# EAGLE schematic imsensor-esp-v01 (EAGLE 7.5.0)
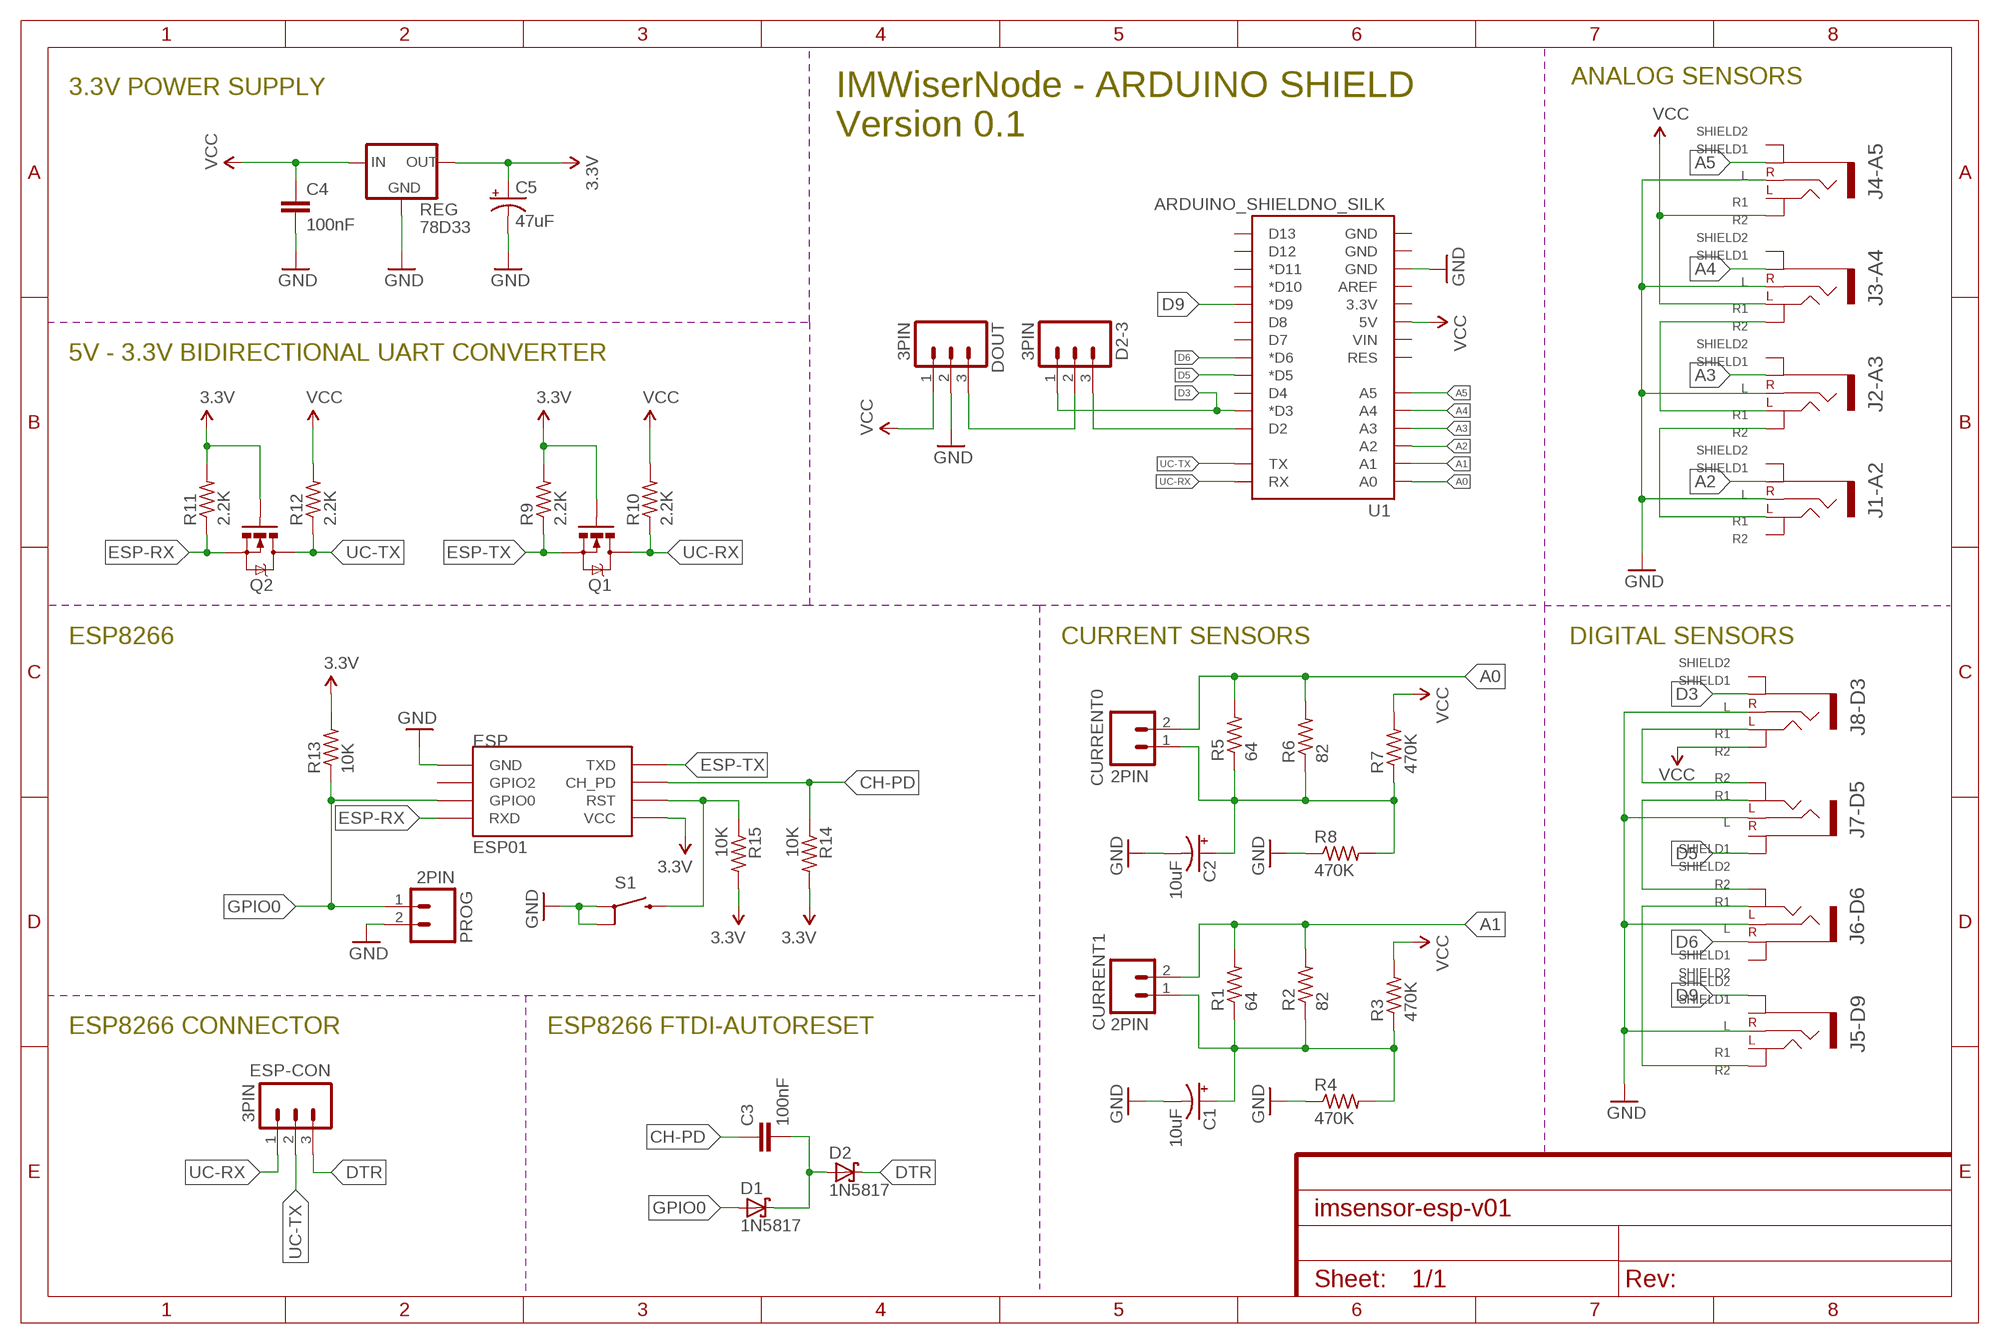
[diagram p0: schematic, sheet 1]
FRAME1 (FRAME-A4L): CNAME: IMSensorNode; CREVISION: REV A; DESIGNER: Jeferson Lima

## Parts
C1  10uF  10UF-25V-20%(PTH)  [CPOL-RADIAL-10UF-25V]
C2  10uF  10UF-25V-20%(PTH)  [CPOL-RADIAL-10UF-25V]
C3  100nF  CAPPTH  [CAP-PTH-SMALL]
C4  100nF  CAPPTH  [CAP-PTH-SMALL]
C5  47uF  10UF-25V-20%(PTH)  [CPOL-RADIAL-10UF-25V]
CURRENT0  2PIN  M02PTH  [1X02]
CURRENT1  2PIN  M02PTH  [1X02]
D1  1N5817  SCHOTTKY-DIODEDO41-7  [DO41-7]
D2  1N5817  SCHOTTKY-DIODEDO41-7  [DO41-7]
D2-3  3PIN  M03PTH  [1X03]
DOUT  3PIN  M03PTH  [1X03]
ESP  ESP01  [ESP01]
ESP-CON  3PIN  M03PTH  [1X03]
J1-A2  PJ-313-SPAD  [PJ-313-5PIN-SMALL]
J2-A3  PJ-313-SPAD  [PJ-313-5PIN-SMALL]
J3-A4  PJ-313-SPAD  [PJ-313-5PIN-SMALL]
J4-A5  PJ-313-SPAD  [PJ-313-5PIN-SMALL]
J5-D9  PJ-313-SPAD  [PJ-313-5PIN-SMALL]
J6-D6  PJ-313-SPAD  [PJ-313-5PIN-SMALL]
J7-D5  PJ-313-SPAD  [PJ-313-5PIN-SMALL]
J8-D3  PJ-313-SPAD  [PJ-313-5PIN-SMALL]
PROG  2PIN  M02PTH  [1X02]
Q1  MOSFET-NCHANNEL2N7000  [TO-92]
Q2  MOSFET-NCHANNEL2N7000  [TO-92]
R1  64  R-US_0207/10  [0207/10]
R2  82  R-US_0207/10  [0207/10]
R3  470K  R-US_0207/10  [0207/10]
R4  470K  R-US_0207/10  [0207/10]
R5  64  R-US_0207/10  [0207/10]
R6  82  R-US_0207/10  [0207/10]
R7  470K  R-US_0207/10  [0207/10]
R8  470K  R-US_0207/10  [0207/10]
R9  2.2K  R-US_0207/10  [0207/10]
R10  2.2K  R-US_0207/10  [0207/10]
R11  2.2K  R-US_0207/10  [0207/10]
R12  2.2K  R-US_0207/10  [0207/10]
R13  10K  R-US_0207/10  [0207/10]
R14  10K  R-US_0207/10  [0207/10]
R15  10K  R-US_0207/10  [0207/10]
REG  78D33  V_REG_78XXSINK  [TO220-IGO]
S1  SWITCH-MOMENTARY-2PTH  [TACTILE-PTH]
U1  ARDUINO_SHIELDNO_SILK  [DUEMILANOVE_VIAS]

## Nets
3.3V: C5.1(+) ESP.VCC Q1.2(G) Q2.2(G) R9.2 R11.2 R13.2 R14.2 R15.2 REG.OUT
A0: CURRENT0.2 R5.2 R6.2 U1.A0
A1: CURRENT1.2 R1.2 R2.2 U1.A1
A2: J1-A2.1.1(SHIELD1) U1.A2
A3: J2-A3.1.1(SHIELD1) U1.A3
A4: J3-A4.1.1(SHIELD1) U1.A4
A5: J4-A5.1.1(SHIELD1) U1.A5
BURDEN-C0: C2.1(+) CURRENT0.1 R5.1 R6.1 R7.1 R8.2
BURDEN-C1: C1.1(+) CURRENT1.1 R1.1 R2.1 R3.1 R4.2
CH-PD: C3.1 ESP.CH_PD R14.1
D3: D2-3.1 J8-D3.1.1(SHIELD1) U1.D3(*D3)
D5: J7-D5.1.2(SHIELD2) U1.D5(*D5)
D6: J6-D6.1.1(SHIELD1) U1.D6(*D6)
D9: J5-D9.1.2(SHIELD2) U1.D9(*D9)
DTR: D2.C ESP-CON.3
ESP-RX: ESP.RX(RXD) Q2.1(S) R11.1
ESP-TX: ESP.TX(TXD) Q1.1(S) R9.1
GND: C1.2(-) C2.2(-) C4.2 C5.2(-) DOUT.2 ESP.GND J1-A2.2(R) J2-A3.2(R) J3-A4.2(R) J4-A5.2(R) J5-D9.2(R) J6-D6.2(R) J7-D5.2(R) J8-D3.2(R) PROG.2 R4.1 R8.1 REG.GND S1.1 S1.2 U1.GND@2(GND)
GPIO0: D1.A ESP.GPIO0 PROG.1 R13.1
N$1: J2-A3.3.1(L1) J3-A4.3.2(L2)
N$2: J1-A2.3.1(L1) J2-A3.3.2(L2)
N$7: J7-D5.3.2(L2) J8-D3.3.1(L1)
N$8: D2-3.2 DOUT.3
N$9: J6-D6.3.2(L2) J7-D5.3.1(L1)
N$14: D2-3.3 U1.D2
N$16: J5-D9.3.2(L2) J6-D6.3.1(L1)
RST: ESP.RST R15.1 S1.3
U$1: C3.2 D1.C D2.A
UC-RX: ESP-CON.1 Q1.3(D) R10.1 U1.RX
UC-TX: ESP-CON.2 Q2.3(D) R12.1 U1.TX
VCC: C4.1 DOUT.1 J3-A4.3.1(L1) J4-A5.3.2(L2) J8-D3.3.2(L2) R3.2 R7.2 R10.2 R12.2 REG.IN U1.5V
Unconnected: ESP.GPIO2 J1-A2.1.2(SHIELD2) J1-A2.3.2(L2) J2-A3.1.2(SHIELD2) J3-A4.1.2(SHIELD2) J4-A5.1.2(SHIELD2) J4-A5.3.1(L1) J5-D9.1.1(SHIELD1) J5-D9.3.1(L1) J6-D6.1.2(SHIELD2) J7-D5.1.1(SHIELD1) J8-D3.1.2(SHIELD2) U1.3.3V U1.AREF U1.D4 U1.D7 U1.D8 U1.D10(*D10) U1.D11(*D11) U1.D12 U1.D13 U1.GND@0(GND) U1.GND@1(GND) U1.RES U1.VIN

## Notes on the sheet
- IMWiserNode - ARDUINO SHIELD
  Version 0.1
- ANALOG SENSORS
- 3.3V POWER SUPPLY
- 5V - 3.3V BIDIRECTIONAL UART CONVERTER
- ESP8266 | CURRENT SENSORS | DIGITAL SENSORS
- ESP8266 CONNECTOR | ESP8266 FTDI-AUTORESET

## Library data of the parts
C1 C2 C5 = SparkFun-Capacitors:10UF-25V-20%(PTH): CAP-08440; PROD_ID: CAP-08440
C3 C4 = SparkFun-Capacitors:CAP: Capacitor Standard 0603 ceramic capacitor, and 0.1" leaded capacitor.
CURRENT0 CURRENT1 PROG = SparkFun-Connectors:M02: Standard 2-pin 0.1" header. Use with - straight break away headers ( PRT-00116) - right angle break away headers (PRT-00553) - swiss pins (PRT-00743) - machine pins (PRT-00117) - female headers (PRT-00115) Molex polarized connector foot print use with: PRT-08233 with associated crimp pins and housings. 2.54_SCREWTERM for use with PRT-10571. 3.5mm Screw Terminal footprints for PRT-08084 5mm Screw Terminal footprints for use with PRT-08432
D1 D2 = adafruit:SCHOTTKY-DIODE: Schottky Diode
D2-3 DOUT ESP-CON = SparkFun-Connectors:M03: Header 3 Standard 3-pin 0.1" header. Use with straight break away headers (SKU : PRT-00116), right angle break away headers (PRT-00553), swiss pins (PRT-00743), machine pins (PRT-00117), and female headers (PRT-00115). Molex polarized connector foot print use with SKU : PRT-08232 with associated crimp pins and housings.
ESP = esp8266-modules:ESP01: ESP8266 Wifi module 01
J1-A2 J2-A3 J3-A4 J4-A5 J5-D9 J6-D6 J7-D5 J8-D3 = salvador-parts:PJ-313-SPAD: PJ-313 with octagon pads PJ-313 with small octagon pads, good for projects which need small footprints
Q1 Q2 = SparkFun-DiscreteSemi:MOSFET-NCHANNEL: Common NMOSFET Parts MFG P/N Store ID Prod ID FDD8780 TRANS-09984 SI7820DN TRANS-11055 FDS6630A IC-08089 2N7002PW TRANS-11151 FQP30N06L COM-10213 TRANS-10060 BSS123LT1G TRANS-08345 BSS138 TRANS-00830 BS170 2N7000
R1-R15 = resistor:R-US_: RESISTOR, American symbol
REG = salvador-parts-imported:V_REG_78XX: Voltage Regulator Standard 78xx regulator. IGO (Input Ground Output). Spark Fun Electronics SKU : COM-00107
S1 = salvador-parts-imported2:SWITCH-MOMENTARY-2: Various NO switches- pushbuttons, reed, etc; PROD_ID: SWCH-08441
U1 = SparkFun-Boards:ARDUINO_SHIELD: Arduino shield footprint